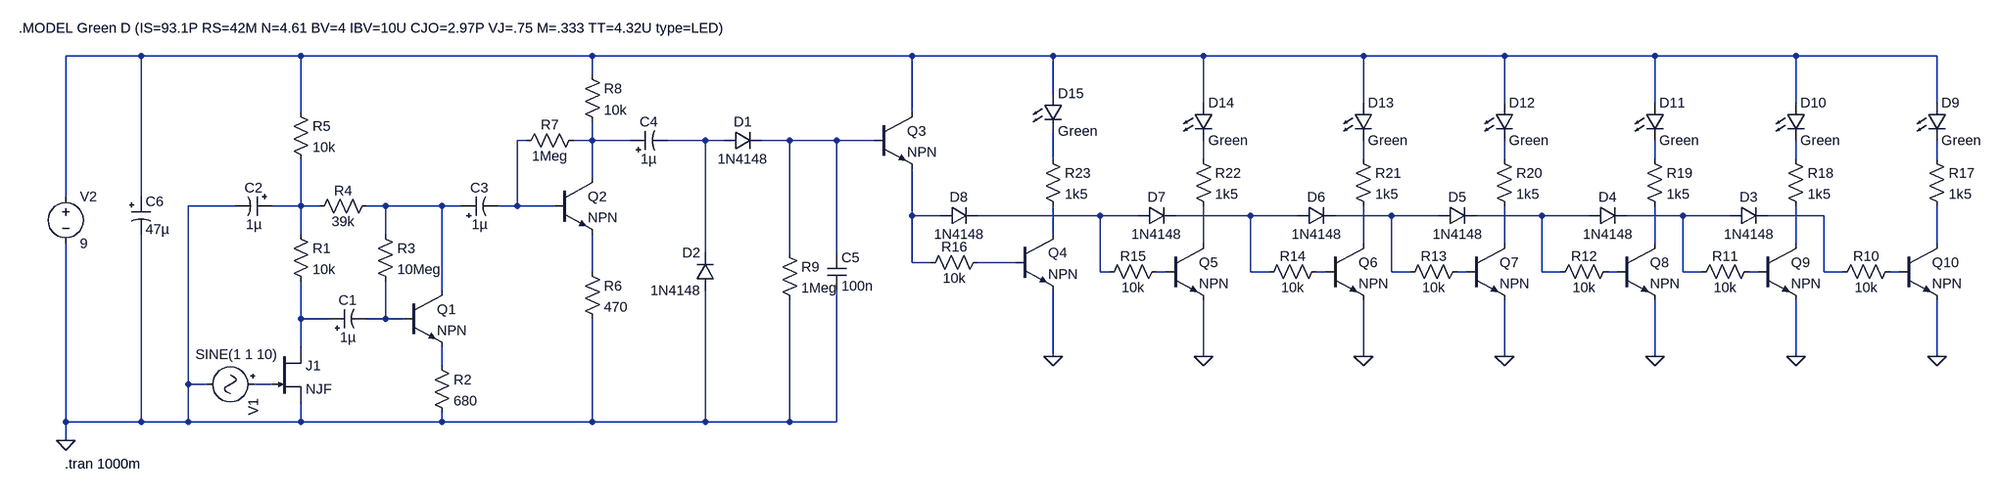
[diagram p0: schematic PMG.asc]
PMG.asc, the LTspice schematic file:
Version 4
SHEET 1 3104 680
WIRE -128 -320 -256 -320
WIRE 144 -320 -128 -320
WIRE 640 -320 144 -320
WIRE 1184 -320 640 -320
WIRE 1424 -320 1184 -320
WIRE 1680 -320 1424 -320
WIRE 1952 -320 1680 -320
WIRE 2192 -320 1952 -320
WIRE 2448 -320 2192 -320
WIRE 2688 -320 2448 -320
WIRE 2928 -320 2688 -320
WIRE 640 -288 640 -320
WIRE 1424 -256 1424 -320
WIRE 1680 -240 1680 -320
WIRE 1952 -240 1952 -320
WIRE 2192 -240 2192 -320
WIRE 2448 -240 2448 -320
WIRE 2688 -240 2688 -320
WIRE 2928 -240 2928 -320
WIRE 144 -224 144 -320
WIRE 1184 -224 1184 -320
WIRE 528 -176 512 -176
WIRE 640 -176 640 -208
WIRE 640 -176 608 -176
WIRE 704 -176 640 -176
WIRE 832 -176 768 -176
WIRE 864 -176 832 -176
WIRE 976 -176 928 -176
WIRE 1056 -176 976 -176
WIRE 1120 -176 1056 -176
WIRE 1424 -144 1424 -192
WIRE 1680 -144 1680 -176
WIRE 1952 -144 1952 -176
WIRE 2192 -144 2192 -176
WIRE 2448 -144 2448 -176
WIRE 2688 -144 2688 -176
WIRE 2928 -144 2928 -176
WIRE 640 -112 640 -176
WIRE -256 -80 -256 -320
WIRE -128 -80 -128 -320
WIRE 32 -64 -48 -64
WIRE 144 -64 144 -144
WIRE 144 -64 96 -64
WIRE 176 -64 144 -64
WIRE 288 -64 256 -64
WIRE 384 -64 288 -64
WIRE 416 -64 384 -64
WIRE 512 -64 512 -176
WIRE 512 -64 480 -64
WIRE 576 -64 512 -64
WIRE 1184 -48 1184 -128
WIRE 1232 -48 1184 -48
WIRE 1504 -48 1296 -48
WIRE 1568 -48 1504 -48
WIRE 1760 -48 1632 -48
WIRE 1840 -48 1760 -48
WIRE 2000 -48 1904 -48
WIRE 2080 -48 2000 -48
WIRE 2256 -48 2144 -48
WIRE 2336 -48 2256 -48
WIRE 2496 -48 2400 -48
WIRE 2576 -48 2496 -48
WIRE 2736 -48 2640 -48
WIRE 144 -16 144 -64
WIRE 288 -16 288 -64
WIRE 1424 -16 1424 -64
WIRE 1680 0 1680 -64
WIRE 1952 0 1952 -64
WIRE 2192 0 2192 -64
WIRE 2448 0 2448 -64
WIRE 2688 0 2688 -64
WIRE 2928 0 2928 -64
WIRE 832 16 832 -176
WIRE 976 16 976 -176
WIRE 1056 16 1056 -176
WIRE 1184 32 1184 -48
WIRE 1216 32 1184 32
WIRE 1360 32 1296 32
WIRE 640 48 640 -16
WIRE 1504 48 1504 -48
WIRE 1520 48 1504 48
WIRE 1616 48 1600 48
WIRE 1760 48 1760 -48
WIRE 1792 48 1760 48
WIRE 1888 48 1872 48
WIRE 2000 48 2000 -48
WIRE 2032 48 2000 48
WIRE 2128 48 2112 48
WIRE 2256 48 2256 -48
WIRE 2288 48 2256 48
WIRE 2384 48 2368 48
WIRE 2496 48 2496 -48
WIRE 2528 48 2496 48
WIRE 2624 48 2608 48
WIRE 2736 48 2736 -48
WIRE 2768 48 2736 48
WIRE 2864 48 2848 48
WIRE 384 80 384 -64
WIRE 144 128 144 64
WIRE 192 128 144 128
WIRE 288 128 288 64
WIRE 288 128 256 128
WIRE 320 128 288 128
WIRE 144 176 144 128
WIRE 1424 192 1424 80
WIRE 1680 192 1680 96
WIRE 1952 192 1952 96
WIRE 2192 192 2192 96
WIRE 2448 192 2448 96
WIRE 2688 192 2688 96
WIRE 2928 192 2928 96
WIRE 384 208 384 176
WIRE -48 240 -48 -64
WIRE -16 240 -48 240
WIRE 96 240 64 240
WIRE -256 304 -256 0
WIRE -128 304 -128 -16
WIRE -128 304 -256 304
WIRE -48 304 -48 240
WIRE -48 304 -128 304
WIRE 144 304 144 272
WIRE 144 304 -48 304
WIRE 384 304 384 288
WIRE 384 304 144 304
WIRE 640 304 640 128
WIRE 640 304 384 304
WIRE 832 304 832 80
WIRE 832 304 640 304
WIRE 976 304 976 96
WIRE 976 304 832 304
WIRE 1056 304 1056 80
WIRE 1056 304 976 304
WIRE -256 336 -256 304
FLAG 1424 192 0
FLAG 1680 192 0
FLAG 1952 192 0
FLAG 2192 192 0
FLAG 2448 192 0
FLAG 2688 192 0
FLAG 2928 192 0
FLAG -256 336 0
SYMBOL Misc\\signal 80 240 R90
WINDOW 3 -51 -24 VRight 2
WINDOW 123 0 0 Left 0
WINDOW 39 0 0 Left 0
SYMATTR InstName V1
SYMATTR Value SINE(1 1 10)
SYMBOL njf 96 176 R0
SYMATTR InstName J1
SYMBOL res 368 192 R0
SYMATTR InstName R2
SYMATTR Value 680
SYMBOL npn 320 80 R0
SYMATTR InstName Q1
SYMBOL Polcap 192 144 R270
WINDOW 0 32 32 VTop 2
WINDOW 3 0 32 VBottom 2
SYMATTR InstName C1
SYMATTR Value 1µ
SYMBOL res 128 -32 R0
SYMATTR InstName R1
SYMATTR Value 10k
SYMBOL res 272 -32 R0
SYMATTR InstName R3
SYMATTR Value 10Meg
SYMBOL res 272 -80 R90
WINDOW 0 5 56 VBottom 2
WINDOW 3 27 56 VTop 2
SYMATTR InstName R4
SYMATTR Value 39k
SYMBOL res 128 -240 R0
SYMATTR InstName R5
SYMATTR Value 10k
SYMBOL voltage -256 -96 R0
WINDOW 123 0 0 Left 0
WINDOW 39 0 0 Left 0
SYMATTR InstName V2
SYMATTR Value 9
SYMBOL Polcap 96 -80 R90
WINDOW 0 0 32 VBottom 2
WINDOW 3 32 32 VTop 2
SYMATTR InstName C2
SYMATTR Value 1µ
SYMBOL Polcap 416 -48 R270
WINDOW 0 32 32 VTop 2
WINDOW 3 0 32 VBottom 2
SYMATTR InstName C3
SYMATTR Value 1µ
SYMBOL npn 576 -112 R0
SYMATTR InstName Q2
SYMBOL res 624 -192 R90
WINDOW 0 5 56 VBottom 2
WINDOW 3 27 56 VTop 2
SYMATTR InstName R7
SYMATTR Value 1Meg
SYMBOL res 624 -304 R0
SYMATTR InstName R8
SYMATTR Value 10k
SYMBOL Polcap 704 -160 R270
WINDOW 0 32 32 VTop 2
WINDOW 3 0 32 VBottom 2
SYMATTR InstName C4
SYMATTR Value 1µ
SYMBOL diode 848 80 R180
WINDOW 0 24 64 Left 2
WINDOW 3 24 0 Left 2
SYMATTR InstName D2
SYMATTR Value 1N4148
SYMBOL diode 864 -160 R270
WINDOW 0 32 32 VTop 2
WINDOW 3 0 32 VBottom 2
SYMATTR InstName D1
SYMATTR Value 1N4148
SYMBOL res 624 32 R0
SYMATTR InstName R6
SYMATTR Value 470
SYMBOL npn 1120 -224 R0
SYMATTR InstName Q3
SYMBOL cap 1040 16 R0
SYMATTR InstName C5
SYMATTR Value 100n
SYMBOL res 960 0 R0
SYMATTR InstName R9
SYMATTR Value 1Meg
SYMBOL npn 1360 -16 R0
SYMATTR InstName Q4
SYMBOL res 1408 -160 R0
SYMATTR InstName R23
SYMATTR Value 1k5
SYMBOL LED 1408 -256 R0
SYMATTR InstName D15
SYMATTR Value Green
SYMBOL res 1312 16 R90
WINDOW 0 5 56 VBottom 2
WINDOW 3 27 56 VTop 2
SYMATTR InstName R16
SYMATTR Value 10k
SYMBOL diode 1232 -32 R270
WINDOW 0 32 32 VTop 2
WINDOW 3 0 32 VBottom 2
SYMATTR InstName D8
SYMATTR Value 1N4148
SYMBOL res 1616 32 R90
WINDOW 0 5 56 VBottom 2
WINDOW 3 27 56 VTop 2
SYMATTR InstName R15
SYMATTR Value 10k
SYMBOL npn 1616 0 R0
SYMATTR InstName Q5
SYMBOL diode 1568 -32 R270
WINDOW 0 32 32 VTop 2
WINDOW 3 0 32 VBottom 2
SYMATTR InstName D7
SYMATTR Value 1N4148
SYMBOL res 1664 -160 R0
SYMATTR InstName R22
SYMATTR Value 1k5
SYMBOL LED 1664 -240 R0
SYMATTR InstName D14
SYMATTR Value Green
SYMBOL npn 1888 0 R0
SYMATTR InstName Q6
SYMBOL res 1888 32 R90
WINDOW 0 5 56 VBottom 2
WINDOW 3 27 56 VTop 2
SYMATTR InstName R14
SYMATTR Value 10k
SYMBOL diode 1840 -32 R270
WINDOW 0 32 32 VTop 2
WINDOW 3 0 32 VBottom 2
SYMATTR InstName D6
SYMATTR Value 1N4148
SYMBOL res 1936 -160 R0
SYMATTR InstName R21
SYMATTR Value 1k5
SYMBOL LED 1936 -240 R0
SYMATTR InstName D13
SYMATTR Value Green
SYMBOL npn 2128 0 R0
SYMATTR InstName Q7
SYMBOL res 2128 32 R90
WINDOW 0 5 56 VBottom 2
WINDOW 3 27 56 VTop 2
SYMATTR InstName R13
SYMATTR Value 10k
SYMBOL diode 2080 -32 R270
WINDOW 0 32 32 VTop 2
WINDOW 3 0 32 VBottom 2
SYMATTR InstName D5
SYMATTR Value 1N4148
SYMBOL res 2176 -160 R0
SYMATTR InstName R20
SYMATTR Value 1k5
SYMBOL LED 2176 -240 R0
SYMATTR InstName D12
SYMATTR Value Green
SYMBOL npn 2384 0 R0
SYMATTR InstName Q8
SYMBOL res 2384 32 R90
WINDOW 0 5 56 VBottom 2
WINDOW 3 27 56 VTop 2
SYMATTR InstName R12
SYMATTR Value 10k
SYMBOL diode 2336 -32 R270
WINDOW 0 32 32 VTop 2
WINDOW 3 0 32 VBottom 2
SYMATTR InstName D4
SYMATTR Value 1N4148
SYMBOL res 2432 -160 R0
SYMATTR InstName R19
SYMATTR Value 1k5
SYMBOL LED 2432 -240 R0
SYMATTR InstName D11
SYMATTR Value Green
SYMBOL npn 2624 0 R0
SYMATTR InstName Q9
SYMBOL res 2624 32 R90
WINDOW 0 5 56 VBottom 2
WINDOW 3 27 56 VTop 2
SYMATTR InstName R11
SYMATTR Value 10k
SYMBOL diode 2576 -32 R270
WINDOW 0 32 32 VTop 2
WINDOW 3 0 32 VBottom 2
SYMATTR InstName D3
SYMATTR Value 1N4148
SYMBOL res 2672 -160 R0
SYMATTR InstName R18
SYMATTR Value 1k5
SYMBOL LED 2672 -240 R0
SYMATTR InstName D10
SYMATTR Value Green
SYMBOL npn 2864 0 R0
SYMATTR InstName Q10
SYMBOL res 2864 32 R90
WINDOW 0 5 56 VBottom 2
WINDOW 3 27 56 VTop 2
SYMATTR InstName R10
SYMATTR Value 10k
SYMBOL res 2912 -160 R0
SYMATTR InstName R17
SYMATTR Value 1k5
SYMBOL LED 2912 -240 R0
SYMATTR InstName D9
SYMATTR Value Green
SYMBOL Polcap -144 -80 R0
SYMATTR InstName C6
SYMATTR Value 47µ
TEXT -336 -368 Left 2 !.MODEL Green D (IS=93.1P RS=42M N=4.61 BV=4 IBV=10U CJO=2.97P VJ=.75 M=.333 TT=4.32U type=LED)
TEXT -258 376 Left 2 !.tran 1000m

The netlist it stands for:
* PMG.asc
V1 N040 0 SINE(1 1 10)
J1 N037 N040 0 NJF
R2 N039 0 680
Q1 N014 N038 N039 0 NPN
C1 N037 N038 1µ
R1 N013 N037 10k
R3 N014 N038 10Meg
R4 N014 N013 39k
R5 N001 N013 10k
V2 N001 0 9
C2 N013 0 1µ
C3 N014 N002 1µ
Q2 N003 N002 N030 0 NPN
R7 N003 N002 1Meg
R8 N001 N003 10k
C4 N003 N004 1µ
D2 0 N004 1N4148
D1 N004 N005 1N4148
R6 N030 0 470
Q3 N001 N005 N015 0 NPN
C5 N005 0 100n
R9 N005 0 1Meg
Q4 N022 N029 0 0 NPN
R23 N006 N022 1k5
D15 N001 N006 Green
R16 N029 N015 10k
D8 N015 N016 1N4148
R15 N031 N016 10k
Q5 N023 N031 0 0 NPN
D7 N016 N017 1N4148
R22 N007 N023 1k5
D14 N001 N007 Green
Q6 N024 N032 0 0 NPN
R14 N032 N017 10k
D6 N017 N018 1N4148
R21 N008 N024 1k5
D13 N001 N008 Green
Q7 N025 N033 0 0 NPN
R13 N033 N018 10k
D5 N018 N019 1N4148
R20 N009 N025 1k5
D12 N001 N009 Green
Q8 N026 N034 0 0 NPN
R12 N034 N019 10k
D4 N019 N020 1N4148
R19 N010 N026 1k5
D11 N001 N010 Green
Q9 N027 N035 0 0 NPN
R11 N035 N020 10k
D3 N020 N021 1N4148
R18 N011 N027 1k5
D10 N001 N011 Green
Q10 N028 N036 0 0 NPN
R10 N036 N021 10k
R17 N012 N028 1k5
D9 N001 N012 Green
C6 N001 0 47µ
.model D D
.lib standard.dio
.model NPN NPN
.model PNP PNP
.lib standard.bjt
.model NJF NJF
.model PJF PJF
.lib standard.jft
.MODEL Green D (IS=93.1P RS=42M N=4.61 BV=4 IBV=10U CJO=2.97P VJ=.75 M=.333 TT=4.32U type=LED)
.tran 1000m
.backanno
.end